# Altium schematic sheet SCH_USB.SchDoc
size A4
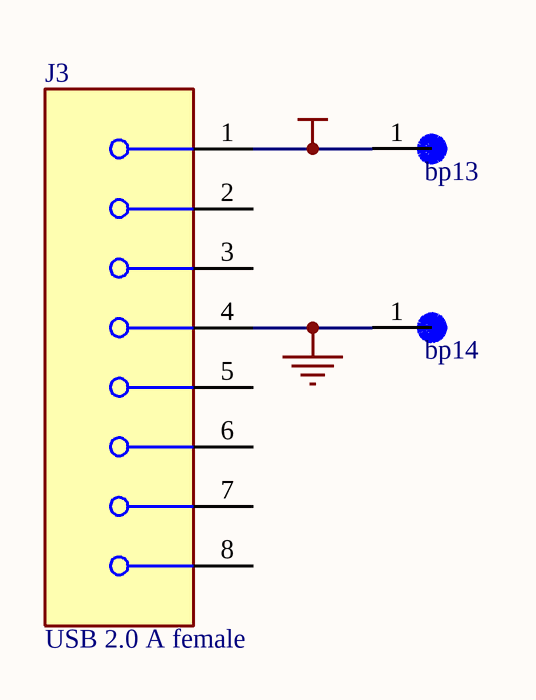
[diagram p0: SCH_USB.SchDoc]

## Parts
bp13  Battery Pad  [Battery pad]  (value not drawn)
bp14  Battery Pad  [Battery pad]  (value not drawn)
J3  USB 2.0 A female  [usbA2F_Molex_67329-8000_0]

## Nets
+5: bp13.1 J3.1
GND: bp14.1 J3.4

Not connected (* = marked no-connect by the designer): J3 2 3 5(MNT_1) 6(MNT_2) 7(MNT_3) 8(MNT_4)

## Library data of the parts
J3 = 67329-8000